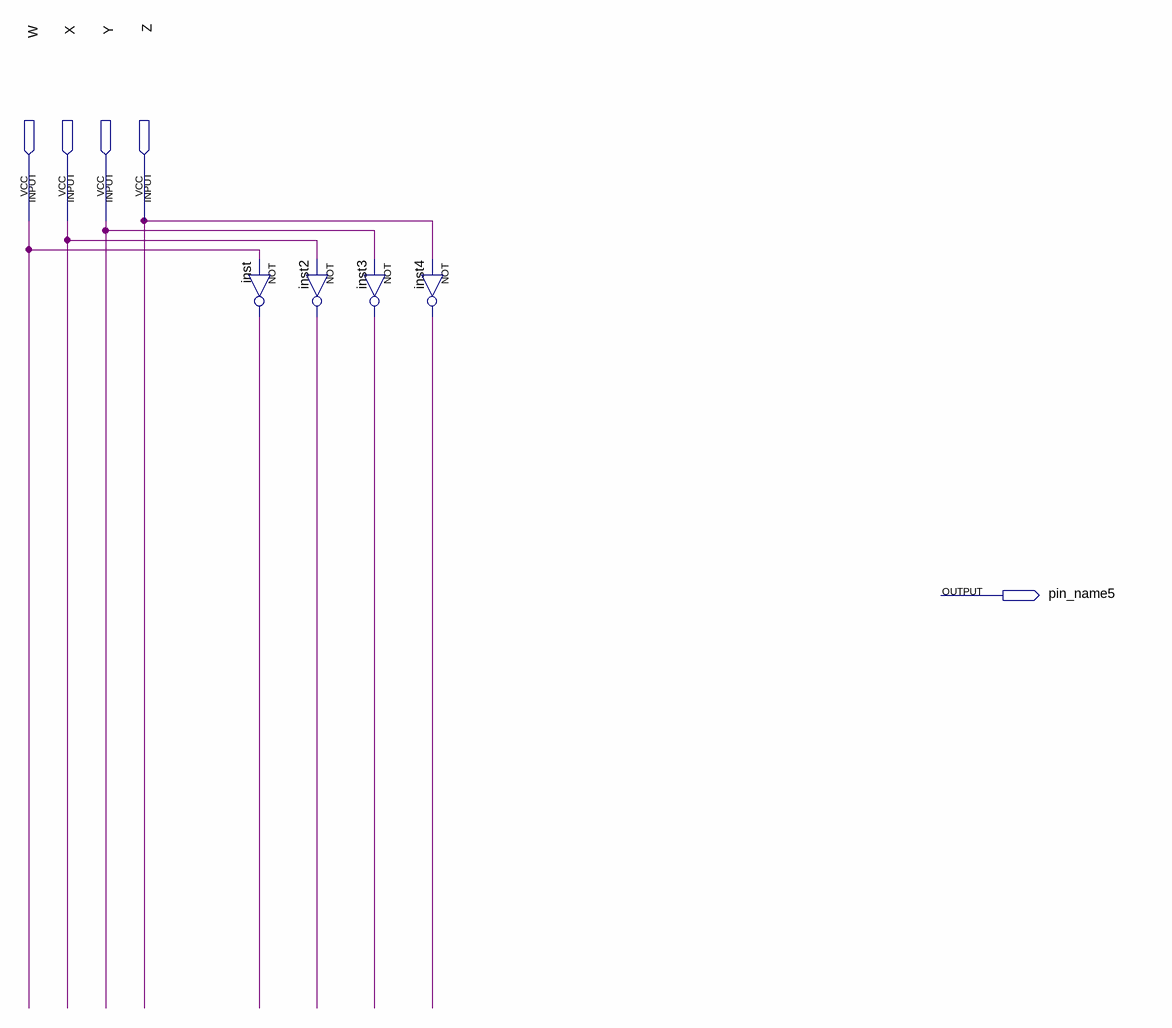
[diagram p0: schematic sheet]
// Quartus schematic template.bdf as structural Verilog: 4 symbols, 5 pins
module template (
  input  W,
  input  X,
  input  Y,
  input  Z,
  output pin_name5
);

  wire inst2_out, inst3_out, inst4_out, inst_out;

  not inst (inst_out, W);
  not inst2 (inst2_out, X);
  not inst3 (inst3_out, Y);
  not inst4 (inst4_out, Z);
endmodule
